# Altium schematic sheet Interface - CAN.SchDoc: [17] Interface - CAN
size A4; ApprovedBy: Nagy Richard; CheckedBy: Nagy Richard; Author: Nagy Richard; CompanyName: EmbedCore; DrawnBy: Nagy Richard; Engineer: Nagy Richard; Organization: EmbedCore; DocumentNumber: 17; Revision: 1.0; SheetNumber: 16; SheetTotal: 25
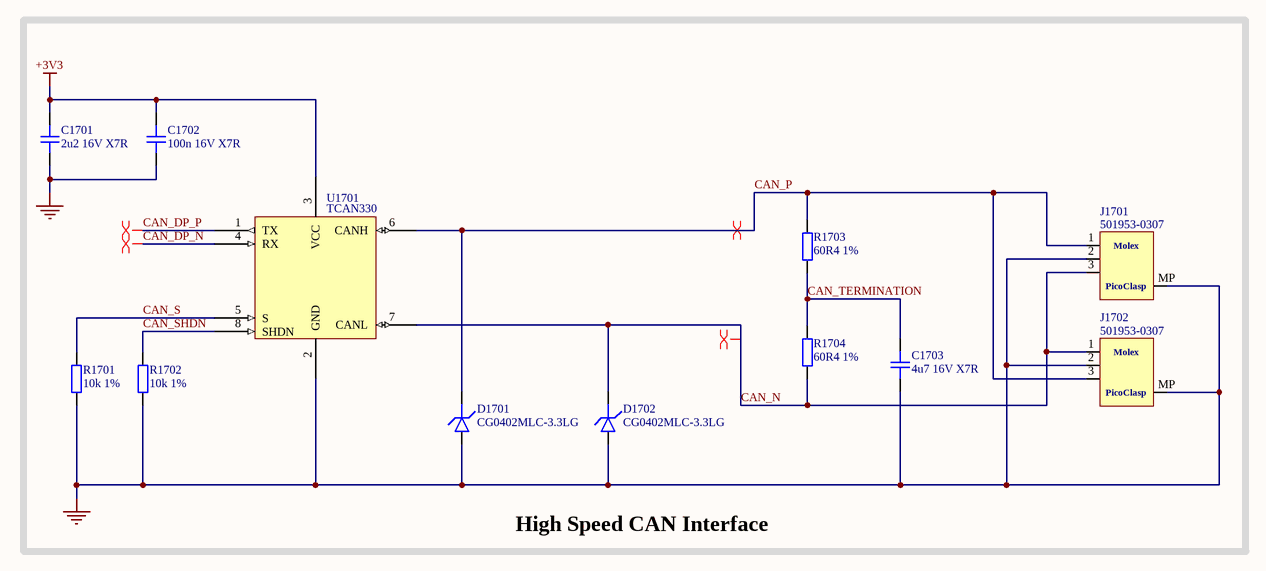
[diagram p0: Interface - CAN.SchDoc]

## Parts
C1701  2u2 16V X7R  [CAP_0603]
C1702  100n 16V X7R  [CAP_0402]
C1703  4u7 16V X7R  [CAP_0402]
D1701  CG0402MLC-3.3LG  [D_0402]
D1702  CG0402MLC-3.3LG  [D_0402]
J1701  501953-0307  [5019530307]
J1702  501953-0307  [5019530307]
R1701  10k 1%  [RES_0402]
R1702  10k 1%  [RES_0402]
R1703  60R4 1%  [RES_0402]
R1704  60R4 1%  [RES_0402]
U1701  TCAN330  [SOIC-8]

## Blocks framed on the sheet
High Speed CAN Interface: C1701-C1703 D1701 D1702 J1701 J1702 R1701-R1704 U1701

## Nets
+3V3: C1701.2 C1702.2 U1701.3(VCC)
GND: C1701.1 C1702.1 C1703.1 D1701.A D1702.A J1701.2 J1701.MP J1702.2 J1702.MP R1701.1 R1702.1 U1701.2(GND)
CAN_DP_N: U1701.4(RX)
CAN_DP_P: U1701.1(TX)
CAN_N: D1702.K J1701.3 J1702.1 R1704.1 U1701.7(CANL)
CAN_P: D1701.K J1701.1 J1702.3 R1703.2 U1701.6(CANH)
CAN_S: R1701.2 U1701.5(S)
CAN_SHDN: R1702.2 U1701.8(SHDN)
CAN_TERMINATION: C1703.2 R1703.1 R1704.2

## Layout directives
differential pair: CAN_DP_N, CAN_DP_P, CAN_N, CAN_P

## Notes on the sheet
- Title:
- Drawn By:
- Page Contents:
- Checked By:
- Size:
- Date:
- File:
- License:
- Email:
- A4
- Number:
- Time:
- Revision:
- Sheet
- Website:
- of
- (in symbol 501953-0307) Molex; PicoClasp

## Library data of the parts
C1701 = CAP_0603: Capacitor SMD 0603; Manufacturer: YAGEO; Manufacturer Part Number: CC0603KRX7R7BB225; Distributor Link: www.lcsc.com; LCSC: C914769; Rating: *; Dielectric: *
C1702 = CAP_0402: Capacitor SMD 0402; Manufacturer: YAGEO; Manufacturer Part Number: CC0402JRX7R7BB104; Distributor Link: www.lcsc.com; LCSC: C541464; Rating: *; Dielectric: *
C1703 = CAP_0402: Capacitor SMD 0402; Manufacturer: Murata Electronics; Manufacturer Part Number: GRM155D81C475ME15D; Distributor Link: www.lcsc.com; LCSC: C5718982; Rating: *; Dielectric: *
D1701 D1702 = D_TVS_0402: Diode TVS / ESD 0402
J1701 J1702 = 501953-0307: Headers & Wire Housings 1.0WtBWaferAssyR/A1- -Row3Ckt+LKEmbsTpPkg
R1701 R1702 = RES_0402: Resistor SMD 0402; Manufacturer: PANASONIC; Manufacturer Part Number: ERJPA2F1002X; Distributor Link: www.lcsc.com; LCSC: C427247
R1703 R1704 = RES_0402: Resistor SMD 0402; Manufacturer: PANASONIC; Manufacturer Part Number: ERJ2RKF60R4X; Distributor Link: www.lcsc.com; LCSC: C416565
U1701 = TCAN330: TCAN33x 3.3-V CAN Transceivers with CAN FD (Flexible Data Rate)